# EasyEDA schematic schematic.json
TITLE: Sheet_1; REV: 1.0; Date: 2024-07-25; Sheet: 1/1; Drawn By: Utvalde; Company: Your Company
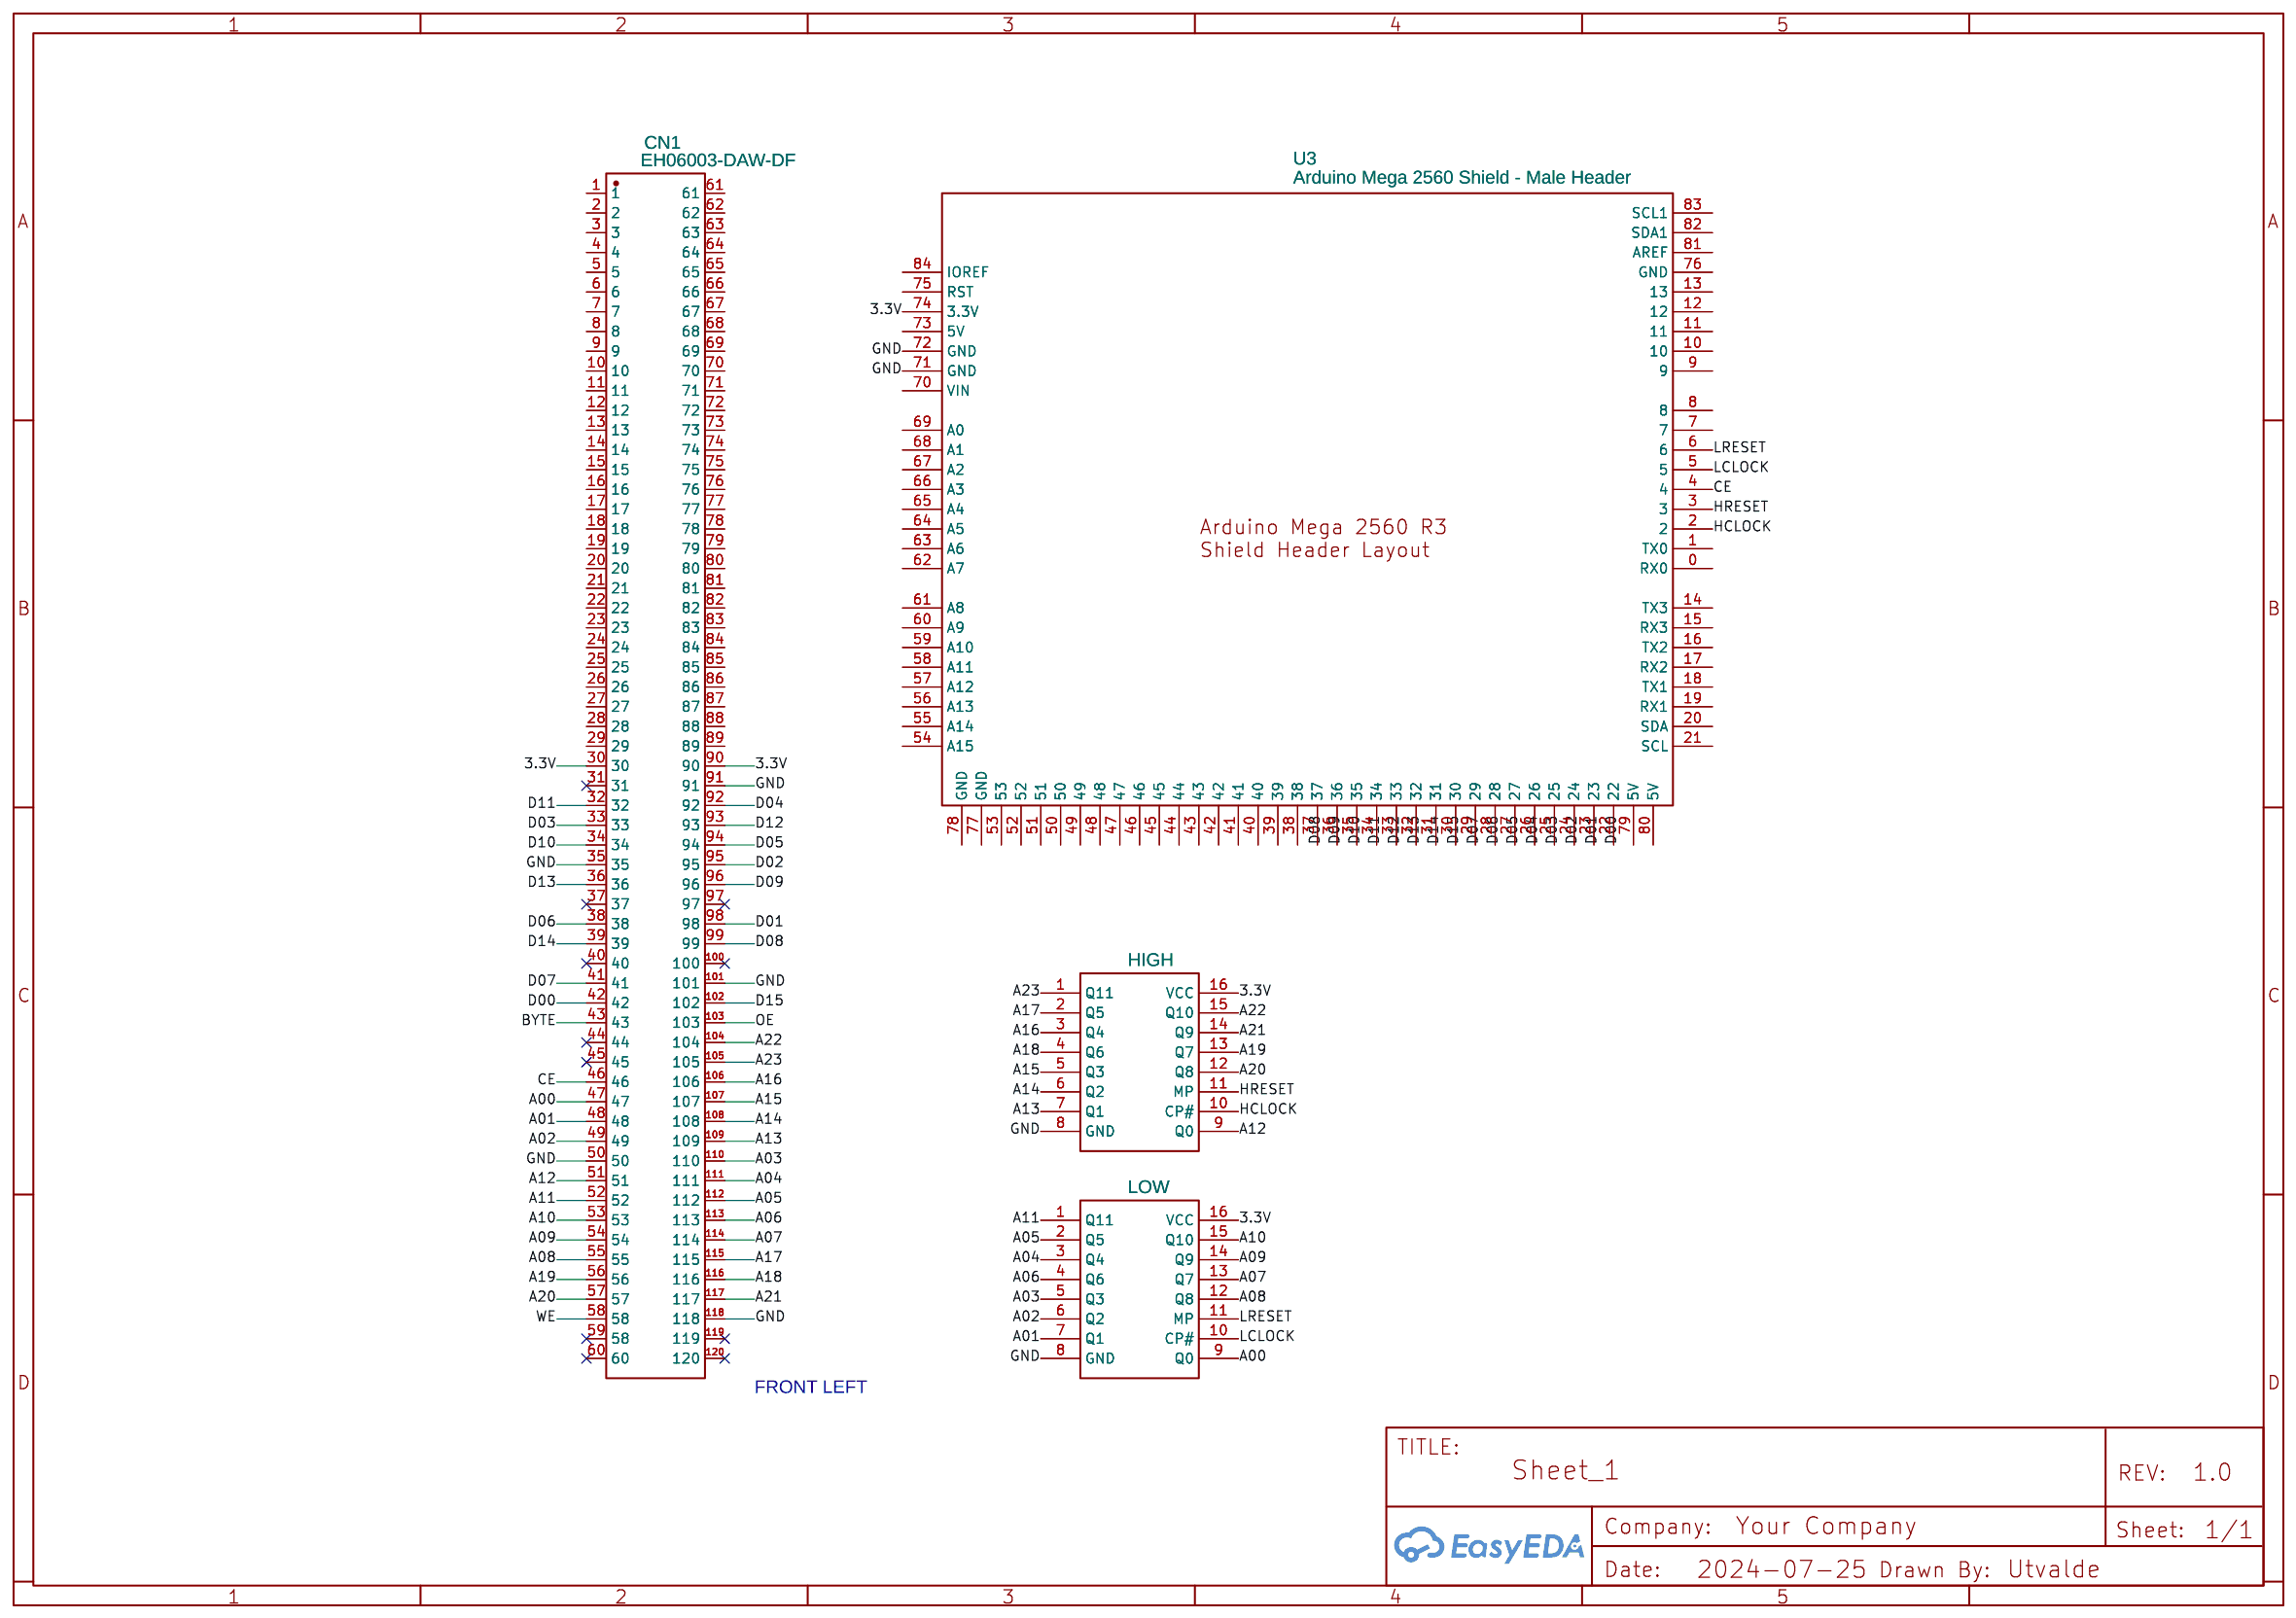
[diagram p0: schematic sheet]

## Parts
CN1  EH06003-DAW-DF  [CONN-TH_EH06003-DAW-DF]
U1  LOW  [SOIC-16_L9.9-W3.9-P1.27-LS6.0-BL]
U2  HIGH  [SOIC-16_L9.9-W3.9-P1.27-LS6.0-BL]
U3  Arduino Mega 2560 Shield - Male Header  [ARDUINO_MEGA_R3_SHIELD_2]

## Library data of the parts
CN1 = EH06003-DAW-DF: Contributor: LCSC; Supplier: LCSC; Supplier Part: C2761459; Manufacturer: FOXCONN(富士康); JLCPCB Part Class: Extended Part
U1 U2 = 74HC4040D,653: Supplier: LCSC; Manufacturer: Nexperia(安世); Supplier Part: C27387; JLCPCB Part Class: Extended Part
U3 = Arduino Mega 2560 Shield - Male Header: Manufacturer Part: None; Supplier Part: undefined; Contributor: tabletonly28

## Nets
3.3V: CN1.30 CN1.90 U1.16(VCC) U2.16(VCC) U3.74(3.3V)
GND: CN1.35 CN1.50 CN1.91 CN1.101 CN1.118 U1.8(GND) U2.8(GND) U3.71(GND) U3.72(GND)
A00: CN1.47 U1.9(Q0)
A01: CN1.48 U1.7(Q1)
A02: CN1.49 U1.6(Q2)
A03: CN1.110 U1.5(Q3)
A04: CN1.111 U1.3(Q4)
A05: CN1.112 U1.2(Q5)
A06: CN1.113 U1.4(Q6)
A07: CN1.114 U1.13(Q7)
A08: CN1.55 U1.12(Q8)
A09: CN1.54 U1.14(Q9)
A10: CN1.53 U1.15(Q10)
A11: CN1.52 U1.1(Q11)
A12: CN1.51 U2.9(Q0)
A13: CN1.109 U2.7(Q1)
A14: CN1.108 U2.6(Q2)
A15: CN1.107 U2.5(Q3)
A16: CN1.106 U2.3(Q4)
A17: CN1.115 U2.2(Q5)
A18: CN1.116 U2.4(Q6)
A19: CN1.56 U2.13(Q7)
A20: CN1.57 U2.12(Q8)
A21: CN1.117 U2.14(Q9)
A22: CN1.104 U2.15(Q10)
A23: CN1.105 U2.1(Q11)
BYTE: CN1.43
CE: CN1.46 U3.4
D00: CN1.42 U3.22
D01: CN1.98 U3.23
D02: CN1.95 U3.24
D03: CN1.33 U3.25
D04: CN1.92 U3.26
D05: CN1.94 U3.27
D06: CN1.38 U3.28
D07: CN1.41 U3.29
D08: CN1.99 U3.37
D09: CN1.96 U3.36
D10: CN1.34 U3.35
D11: CN1.32 U3.34
D12: CN1.93 U3.33
D13: CN1.36 U3.32
D14: CN1.39 U3.31
D15: CN1.102 U3.30
HCLOCK: U2.10(CP#) U3.2
HRESET: U2.11(MP) U3.3
LCLOCK: U1.10(CP#) U3.5
LRESET: U1.11(MP) U3.6
OE: CN1.103
WE: CN1.58

Not connected (* = marked no-connect by the designer): CN1 1 2 3 4 5 6 7 8 9 10 11 12 13 14 15 16 17 18 19 20 21 22 23 24 25 26 27 28 29 31* 37* 40* 44* 45* 59(58)* 60* 61 62 63 64 65 66 67 68 69 70 71 72 73 74 75 76 77 78 79 80 81 82 83 84 85 86 87 88 89 97* 100* 119* 120*; U3 0(RX0) 1(TX0) 7 8 9 10 11 12 13 14(TX3) 15(RX3) 16(TX2) 17(RX2) 18(TX1) 19(RX1) 20(SDA) 21(SCL) 38 39 40 41 42 43 44 45 46 47 48 49 50 51 52 53 54(A15) 55(A14) 56(A13) 57(A12) 58(A11) 59(A10) 60(A9) 61(A8) 62(A7) 63(A6) 64(A5) 65(A4) 66(A3) 67(A2) 68(A1) 69(A0) 70(VIN) 73(5V) 75(RST) 76(GND) 77(GND) 78(GND) 79(5V) 80(5V) 81(AREF) 82(SDA1) 83(SCL1) 84(IOREF)

## Notes on the sheet
- FRONT LEFT
